# Altium project beagle_bone_cape.PrjPcb
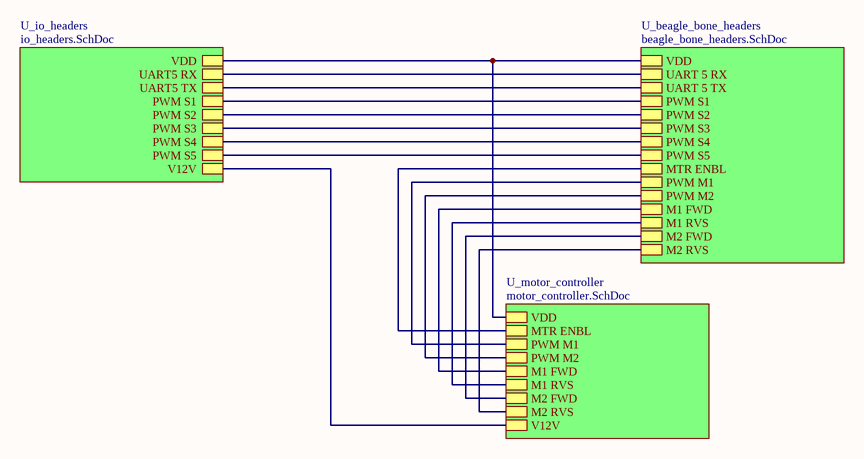
[diagram p0: beagle_bone_cape.SchDoc]
4 sheets, 16 parts. Net scope: hierarchical (ports join the sheet entries above them; power ports are global).
Board file: Beagle_bone_cape.PcbDoc
Sheets:
  beagle_bone_cape.SchDoc
    U_beagle_bone_headers = beagle_bone_headers.SchDoc
    U_io_headers = io_headers.SchDoc
    U_motor_controller = motor_controller.SchDoc

## Sheet beagle_bone_cape.SchDoc
size A4

### Sub-sheets
U_beagle_bone_headers = beagle_bone_headers.SchDoc: VDD, PWM S1, PWM S2, PWM S3, PWM S4, PWM S5, PWM M1, PWM M2, UART 5 RX, UART 5 TX, M2 FWD, M1 FWD, M1 RVS, M2 RVS, MTR ENBL
U_io_headers = io_headers.SchDoc: V12V, VDD, PWM S1, PWM S2, PWM S3, PWM S4, PWM S5, UART5 TX, UART5 RX
U_motor_controller = motor_controller.SchDoc: VDD, MTR ENBL, PWM M1, PWM M2, M1 FWD, M1 RVS, M2 FWD, M2 RVS, V12V

### Nets
NetC1_2: sheet U_io_headers/V12V, sheet U_motor_controller/V12V
NetC2_2: sheet U_beagle_bone_headers/VDD, sheet U_io_headers/VDD, sheet U_motor_controller/VDD
NetHEADER2_1: sheet U_beagle_bone_headers/PWM S1, sheet U_io_headers/PWM S1
NetHEADER2_2: sheet U_beagle_bone_headers/PWM S2, sheet U_io_headers/PWM S2
NetHEADER2_3: sheet U_beagle_bone_headers/PWM S3, sheet U_io_headers/PWM S3
NetHEADER2_4: sheet U_beagle_bone_headers/PWM S4, sheet U_io_headers/PWM S4
NetHEADER2_5: sheet U_beagle_bone_headers/PWM S5, sheet U_io_headers/PWM S5
NetHEADER4_1: sheet U_beagle_bone_headers/UART 5 TX, sheet U_io_headers/UART5 TX
NetHEADER4_2: sheet U_beagle_bone_headers/UART 5 RX, sheet U_io_headers/UART5 RX
NetHEADER_P8_3: sheet U_beagle_bone_headers/M1 FWD, sheet U_motor_controller/M1 FWD
NetHEADER_P8_4: sheet U_beagle_bone_headers/M1 RVS, sheet U_motor_controller/M1 RVS
NetHEADER_P8_5: sheet U_beagle_bone_headers/M2 FWD, sheet U_motor_controller/M2 FWD
NetHEADER_P8_6: sheet U_beagle_bone_headers/M2 RVS, sheet U_motor_controller/M2 RVS
NetHEADER_P8_11: sheet U_beagle_bone_headers/MTR ENBL, sheet U_motor_controller/MTR ENBL
NetHEADER_P9_28: sheet U_beagle_bone_headers/PWM M2, sheet U_motor_controller/PWM M2
NetHEADER_P9_42: sheet U_beagle_bone_headers/PWM M1, sheet U_motor_controller/PWM M1

## Sheet beagle_bone_headers.SchDoc
size A4
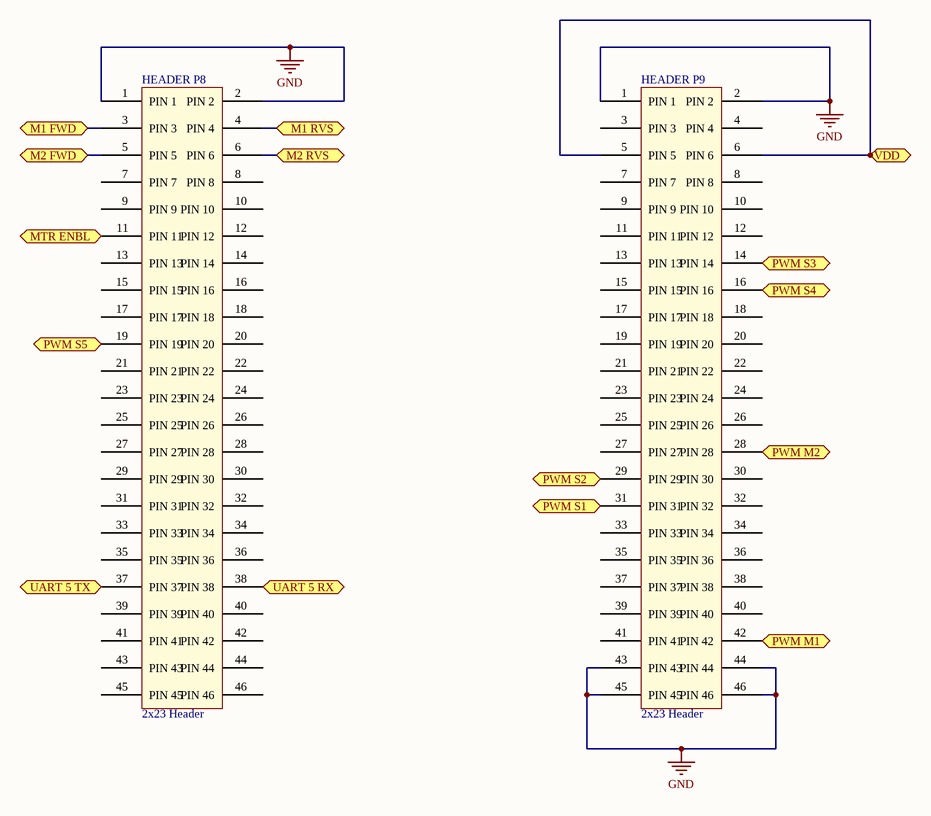
[diagram p1: beagle_bone_headers.SchDoc]

### Parts
HEADER_P8  2x23 Header  [2x23 Header]
HEADER_P9  2x23 Header  [2x23 Header]

### Ports
M1 FWD, M1 RVS, M2 FWD, M2 RVS, MTR ENBL, PWM M1, PWM M2, PWM S1, PWM S2, PWM S3, PWM S4, PWM S5, UART 5 RX, UART 5 TX, VDD

### Nets
GND: HEADER_P8.1(PIN_1) HEADER_P8.2(PIN_2) HEADER_P9.1(PIN_1) HEADER_P9.2(PIN_2) HEADER_P9.43(PIN_43) HEADER_P9.44(PIN_44) HEADER_P9.45(PIN_45) HEADER_P9.46(PIN_46)
NetC2_2: HEADER_P9.5(PIN_5) HEADER_P9.6(PIN_6) ; port VDD
NetHEADER2_1: HEADER_P9.31(PIN_31) ; port PWM S1
NetHEADER2_2: HEADER_P9.29(PIN_29) ; port PWM S2
NetHEADER2_3: HEADER_P9.14(PIN_14) ; port PWM S3
NetHEADER2_4: HEADER_P9.16(PIN_16) ; port PWM S4
NetHEADER2_5: HEADER_P8.19(PIN_19) ; port PWM S5
NetHEADER4_1: HEADER_P8.37(PIN_37) ; port UART 5 TX
NetHEADER4_2: HEADER_P8.38(PIN_38) ; port UART 5 RX
NetHEADER_P8_3: HEADER_P8.3(PIN_3) ; port M1 FWD
NetHEADER_P8_4: HEADER_P8.4(PIN_4) ; port M1 RVS
NetHEADER_P8_5: HEADER_P8.5(PIN_5) ; port M2 FWD
NetHEADER_P8_6: HEADER_P8.6(PIN_6) ; port M2 RVS
NetHEADER_P8_11: HEADER_P8.11(PIN_11) ; port MTR ENBL
NetHEADER_P9_28: HEADER_P9.28(PIN_28) ; port PWM M2
NetHEADER_P9_42: HEADER_P9.42(PIN_42) ; port PWM M1

Not connected (* = marked no-connect by the designer): HEADER_P8 7(PIN_7) 8(PIN_8) 9(PIN_9) 10(PIN_10) 12(PIN_12) 13(PIN_13) 14(PIN_14) 15(PIN_15) 16(PIN_16) 17(PIN_17) 18(PIN_18) 20(PIN_20) 21(PIN_21) 22(PIN_22) 23(PIN_23) 24(PIN_24) 25(PIN_25) 26(PIN_26) 27(PIN_27) 28(PIN_28) 29(PIN_29) 30(PIN_30) 31(PIN_31) 32(PIN_32) 33(PIN_33) 34(PIN_34) 35(PIN_35) 36(PIN_36) 39(PIN_39) 40(PIN_40) 41(PIN_41) 42(PIN_42) 43(PIN_43) 44(PIN_44) 45(PIN_45) 46(PIN_46); HEADER_P9 3(PIN_3) 4(PIN_4) 7(PIN_7) 8(PIN_8) 9(PIN_9) 10(PIN_10) 11(PIN_11) 12(PIN_12) 13(PIN_13) 15(PIN_15) 17(PIN_17) 18(PIN_18) 19(PIN_19) 20(PIN_20) 21(PIN_21) 22(PIN_22) 23(PIN_23) 24(PIN_24) 25(PIN_25) 26(PIN_26) 27(PIN_27) 30(PIN_30) 32(PIN_32) 33(PIN_33) 34(PIN_34) 35(PIN_35) 36(PIN_36) 37(PIN_37) 38(PIN_38) 39(PIN_39) 40(PIN_40) 41(PIN_41)

## Sheet io_headers.SchDoc
size A4
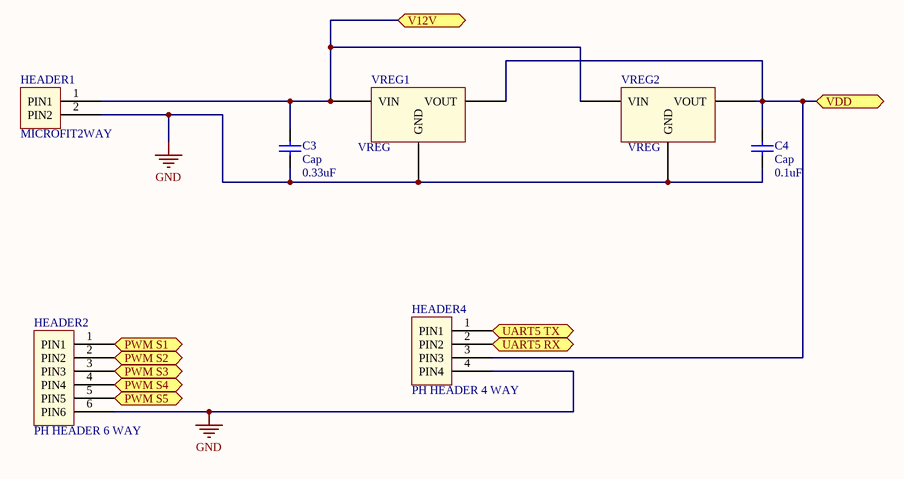
[diagram p2: io_headers.SchDoc]

### Parts
C3  Cap  value 0.33uF  [RAD-0.3]
C4  Cap  value 0.1uF  [RAD-0.3]
HEADER1  MICROFIT2WAY  [MICROFIT2WAY]
HEADER2  PH HEADER 6 WAY  [PH CONNECTOR 6 WAY]
HEADER4  PH HEADER 4 WAY  [PH_HEADER 4WAY]
VREG1  VREG  [TO-220 VREG]
VREG2  VREG  [TO-220 VREG]

### Ports
PWM S1, PWM S2, PWM S3, PWM S4, PWM S5, UART5 RX, UART5 TX, V12V, VDD

### Nets
GND: C3.1 C4.1 HEADER1.2(PIN2) HEADER2.6(PIN6) HEADER4.4(PIN4) VREG1.2(GND) VREG2.2(GND)
NetC1_2: C3.2 HEADER1.1(PIN1) VREG1.1(VIN) VREG2.1(VIN) ; port V12V
NetC2_2: C4.2 HEADER4.3(PIN3) VREG1.3(VOUT) VREG2.3(VOUT) ; port VDD
NetHEADER2_1: HEADER2.1(PIN1) ; port PWM S1
NetHEADER2_2: HEADER2.2(PIN2) ; port PWM S2
NetHEADER2_3: HEADER2.3(PIN3) ; port PWM S3
NetHEADER2_4: HEADER2.4(PIN4) ; port PWM S4
NetHEADER2_5: HEADER2.5(PIN5) ; port PWM S5
NetHEADER4_1: HEADER4.1(PIN1) ; port UART5 TX
NetHEADER4_2: HEADER4.2(PIN2) ; port UART5 RX

### Library data of the parts
C3 C4 = Cap: Capacitor; Published: 8-Jun-2000; LatestRevisionDate: 17-Jul-2002; LatestRevisionNote: Re-released for DXP Platform.; PackageReference: RAD-0.3; Publisher: Altium Limited; PackageDescription: Radial Cap, Thru-Hole; 2 Leads; 0.3 in Pin Spacing
HEADER1 = MICROFIT2WAY HEADER
VREG1 VREG2 = VOLTAGE REGULATOR

## Sheet motor_controller.SchDoc
size A4
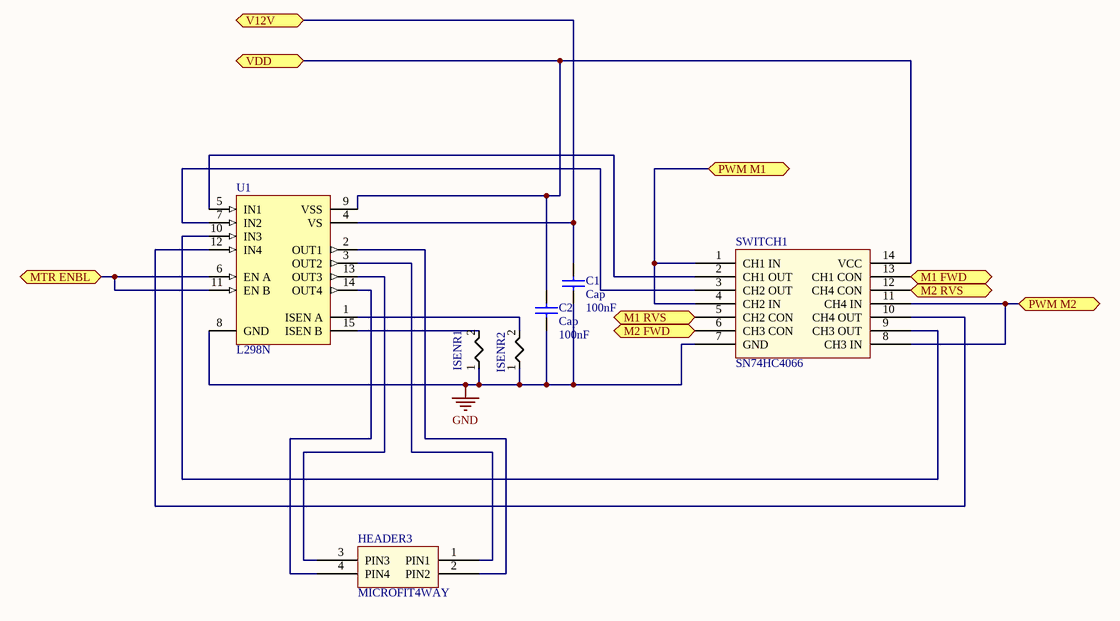
[diagram p3: motor_controller.SchDoc]

### Parts
C1  Cap  value 100nF  [RAD-0.3]
C2  Cap  value 100nF  [RAD-0.3]
HEADER3  MICROFIT4WAY  [MULTIFIT-4WAY]
ISENR1  CURRENT SENSE RESISTOR  [CURRENT_SENSE_RESISTOR]  (value not drawn)
ISENR2  CURRENT SENSE RESISTOR  [CURRENT_SENSE_RESISTOR]  (value not drawn)
SWITCH1  SN74HC4066  [SN74HC4066_DIP]
U1  L298N  [Multiwatt15V]

### Ports
M1 FWD, M1 RVS, M2 FWD, M2 RVS, MTR ENBL, PWM M1, PWM M2, V12V, VDD

### Nets
GND: C1.1 C2.1 ISENR1.1(PIN1) ISENR2.1(PIN1) SWITCH1.7(GND) U1.8(GND)
NetC1_2: C1.2 U1.4(VS) ; port V12V
NetC2_2: C2.2 SWITCH1.14(VCC) U1.9(VSS) ; port VDD
NetHEADER3_1: HEADER3.1(PIN1) U1.3(OUT2)
NetHEADER3_2: HEADER3.2(PIN2) U1.2(OUT1)
NetHEADER3_3: HEADER3.3(PIN3) U1.13(OUT3)
NetHEADER3_4: HEADER3.4(PIN4) U1.14(OUT4)
NetHEADER_P8_3: SWITCH1.13(CH1_CON) ; port M1 FWD
NetHEADER_P8_4: SWITCH1.5(CH2_CON) ; port M1 RVS
NetHEADER_P8_5: SWITCH1.6(CH3_CON) ; port M2 FWD
NetHEADER_P8_6: SWITCH1.12(CH4_CON) ; port M2 RVS
NetHEADER_P8_11: U1.6(EN_A) U1.11(EN_B) ; port MTR ENBL
NetHEADER_P9_28: SWITCH1.8(CH3_IN) SWITCH1.11(CH4_IN) ; port PWM M2
NetHEADER_P9_42: SWITCH1.1(CH1_IN) SWITCH1.4(CH2_IN) ; port PWM M1
NetISENR1_2: ISENR1.2(PIN2) U1.15(ISEN_B)
NetISENR2_2: ISENR2.2(PIN2) U1.1(ISEN_A)
NetSWITCH1_2: SWITCH1.2(CH1_OUT) U1.5(IN1)
NetSWITCH1_3: SWITCH1.3(CH2_OUT) U1.7(IN2)
NetSWITCH1_9: SWITCH1.9(CH3_OUT) U1.10(IN3)
NetSWITCH1_10: SWITCH1.10(CH4_OUT) U1.12(IN4)

### Library data of the parts
C1 C2 = Cap: Capacitor; Published: 8-Jun-2000; LatestRevisionDate: 17-Jul-2002; LatestRevisionNote: Re-released for DXP Platform.; PackageReference: RAD-0.3; Publisher: Altium Limited; PackageDescription: Radial Cap, Thru-Hole; 2 Leads; 0.3 in Pin Spacing
HEADER3 = MICROFIT4WAY HEADER
SWITCH1 = SN74HC4066 SWITCH
U1 = L298N: Dual Full Bridge Driver; Published: 8-Jun-2000; LatestRevisionDate: 14-May-2007; LatestRevisionNote: Mapped to vertical PCB.; DatasheetVersion: Jul-1999; PackageReference: Multiwatt15V; Publisher: Altium Limited; PackageDescription: TO, Thru-Hole, Vertical, Heatsink Mounted; 15 Bent Staggered Leads; Pitch 1.27 mm; ComponentLink1Description: Manufacturer Link; ComponentLink1URL: http://www.st.com/; ComponentLink2Description: Datasheet; ComponentLink2URL: http://www.st.com/stonline/products/literature/ds/1773/l298.pdf

## Nets that join several sheets
GND: beagle_bone_headers (8 pins), io_headers (7 pins), motor_controller (6 pins)
NetC1_2: io_headers (C3.2 HEADER1.1 VREG1.1 VREG2.1), motor_controller (C1.2 U1.4)
NetC2_2: beagle_bone_headers (HEADER_P9.5 HEADER_P9.6), io_headers (C4.2 HEADER4.3 VREG1.3 VREG2.3), motor_controller (C2.2 SWITCH1.14 U1.9)
NetHEADER2_1: beagle_bone_headers (HEADER_P9.31), io_headers (HEADER2.1)
NetHEADER2_2: beagle_bone_headers (HEADER_P9.29), io_headers (HEADER2.2)
NetHEADER2_3: beagle_bone_headers (HEADER_P9.14), io_headers (HEADER2.3)
NetHEADER2_4: beagle_bone_headers (HEADER_P9.16), io_headers (HEADER2.4)
NetHEADER2_5: beagle_bone_headers (HEADER_P8.19), io_headers (HEADER2.5)
NetHEADER4_1: beagle_bone_headers (HEADER_P8.37), io_headers (HEADER4.1)
NetHEADER4_2: beagle_bone_headers (HEADER_P8.38), io_headers (HEADER4.2)
NetHEADER_P8_3: beagle_bone_headers (HEADER_P8.3), motor_controller (SWITCH1.13)
NetHEADER_P8_4: beagle_bone_headers (HEADER_P8.4), motor_controller (SWITCH1.5)
NetHEADER_P8_5: beagle_bone_headers (HEADER_P8.5), motor_controller (SWITCH1.6)
NetHEADER_P8_6: beagle_bone_headers (HEADER_P8.6), motor_controller (SWITCH1.12)
NetHEADER_P8_11: beagle_bone_headers (HEADER_P8.11), motor_controller (U1.6 U1.11)
NetHEADER_P9_28: beagle_bone_headers (HEADER_P9.28), motor_controller (SWITCH1.8 SWITCH1.11)
NetHEADER_P9_42: beagle_bone_headers (HEADER_P9.42), motor_controller (SWITCH1.1 SWITCH1.4)